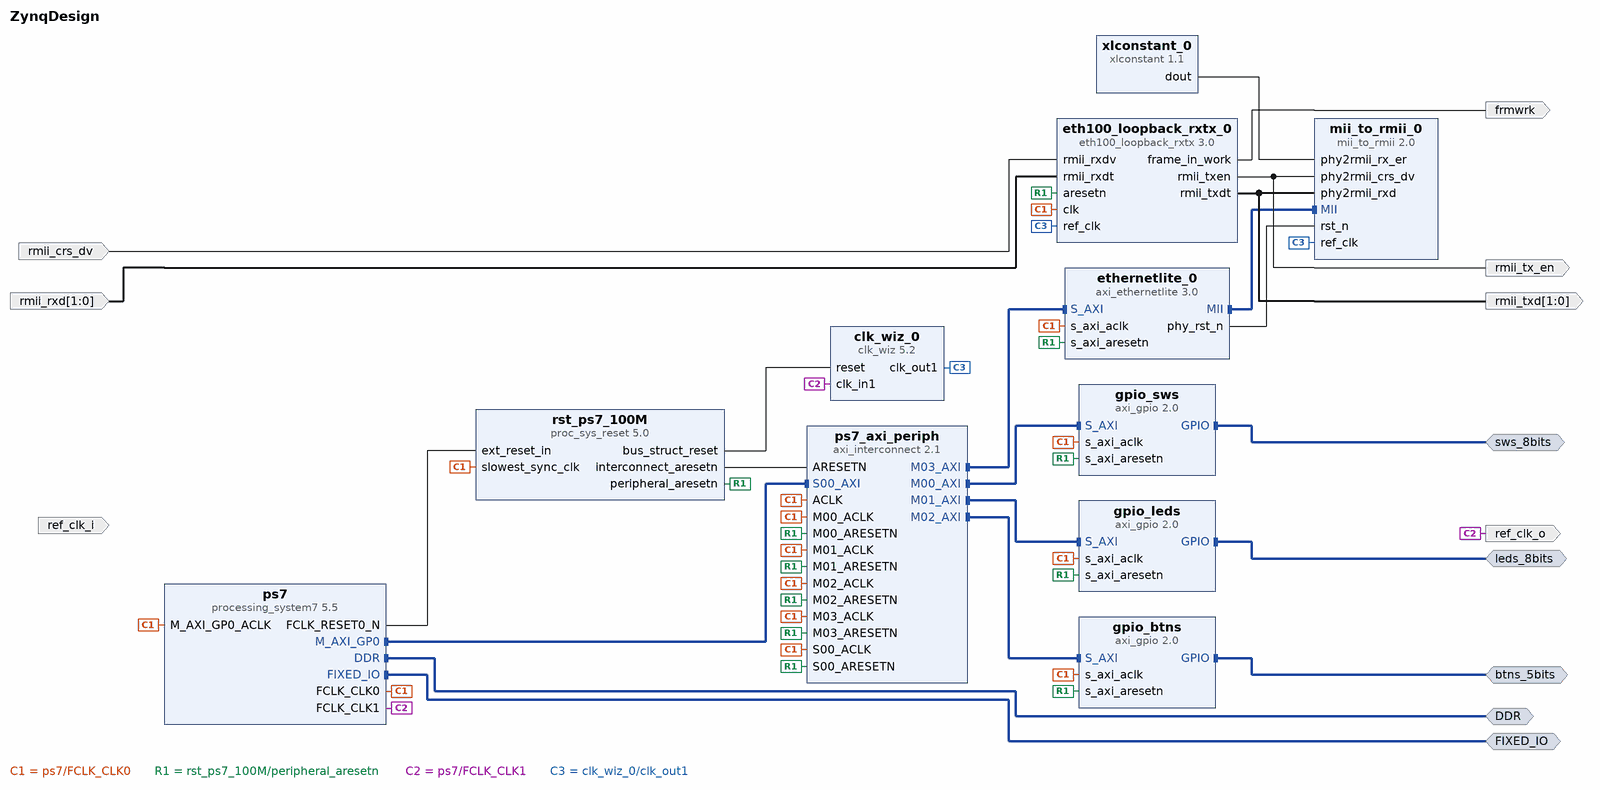
[diagram p0: block diagram of the top level]
# Vivado block design ZynqDesign, Vivado 2015.3
create_bd_design ZynqDesign

create_bd_intf_port -mode Master -vlnv xilinx.com:interface:ddrx_rtl:1.0 DDR
create_bd_intf_port -mode Master -vlnv xilinx.com:display_processing_system7:fixedio_rtl:1.0 FIXED_IO
create_bd_intf_port -mode Master -vlnv xilinx.com:interface:gpio_rtl:1.0 sws_8bits
create_bd_intf_port -mode Master -vlnv xilinx.com:interface:gpio_rtl:1.0 leds_8bits
create_bd_intf_port -mode Master -vlnv xilinx.com:interface:gpio_rtl:1.0 btns_5bits
create_bd_port -dir I -type clk ref_clk_i
set_property -dict {CONFIG.FREQ_HZ 50000000} [get_bd_ports ref_clk_i]
create_bd_port -dir O -type clk ref_clk_o
create_bd_port -dir O rmii_tx_en
create_bd_port -dir O -from 1 -to 0 rmii_txd
create_bd_port -dir I rmii_crs_dv
create_bd_port -dir I -from 1 -to 0 rmii_rxd
create_bd_port -dir O -type data frmwrk

create_bd_cell -type ip -vlnv xilinx.com:ip:processing_system7:5.5 ps7
set_property -dict [list \
  CONFIG.PCW_FPGA1_PERIPHERAL_FREQMHZ 50 \
  CONFIG.PCW_EN_CLK1_PORT 1 \
  CONFIG.PCW_QSPI_GRP_SINGLE_SS_ENABLE 1 \
  CONFIG.preset ZedBoard \
] [get_bd_cells ps7]
# 1 more settings of ps7 are not shown: defaults, MIO pin electricals, DDR timing, and values the tool derives
create_bd_cell -type ip -vlnv xilinx.com:ip:axi_gpio:2.0 gpio_sws
set_property -dict {CONFIG.USE_BOARD_FLOW true CONFIG.GPIO_BOARD_INTERFACE sws_8bits} [get_bd_cells gpio_sws]
create_bd_cell -type ip -vlnv xilinx.com:ip:axi_interconnect:2.1 ps7_axi_periph
set_property -dict {CONFIG.NUM_MI 4} [get_bd_cells ps7_axi_periph]
create_bd_cell -type ip -vlnv xilinx.com:ip:proc_sys_reset:5.0 rst_ps7_100M
create_bd_cell -type ip -vlnv xilinx.com:ip:axi_gpio:2.0 gpio_leds
set_property -dict {CONFIG.USE_BOARD_FLOW true CONFIG.GPIO_BOARD_INTERFACE leds_8bits} [get_bd_cells gpio_leds]
create_bd_cell -type ip -vlnv xilinx.com:ip:axi_gpio:2.0 gpio_btns
set_property -dict {CONFIG.USE_BOARD_FLOW true CONFIG.GPIO_BOARD_INTERFACE btns_5bits} [get_bd_cells gpio_btns]
create_bd_cell -type ip -vlnv xilinx.com:ip:axi_ethernetlite:3.0 ethernetlite_0
set_property -dict {CONFIG.C_INCLUDE_INTERNAL_LOOPBACK 1 CONFIG.C_INCLUDE_MDIO 0} [get_bd_cells ethernetlite_0]
create_bd_cell -type ip -vlnv xilinx.com:ip:mii_to_rmii:2.0 mii_to_rmii_0
create_bd_cell -type ip -vlnv xilinx.com:ip:xlconstant:1.1 xlconstant_0
set_property -dict {CONFIG.CONST_VAL 0} [get_bd_cells xlconstant_0]
create_bd_cell -type ip -vlnv xilinx.com:ip:clk_wiz:5.2 clk_wiz_0
set_property -dict [list \
  CONFIG.CLKOUT1_REQUESTED_OUT_FREQ 50 \
  CONFIG.CLKOUT1_REQUESTED_PHASE 180 \
  CONFIG.MMCM_DIVCLK_DIVIDE 1 \
  CONFIG.MMCM_CLKOUT0_DIVIDE_F 20.000 \
  CONFIG.MMCM_CLKOUT0_PHASE 180.000 \
  CONFIG.CLKOUT1_JITTER 192.113 \
] [get_bd_cells clk_wiz_0]
create_bd_cell -type ip -vlnv jsykora.info:user:eth100_loopback_rxtx:3.0 eth100_loopback_rxtx_0

# ---- connections ----

connect_bd_intf_net -intf_net processing_system7_0_M_AXI_GP0 [get_bd_intf_pins ps7/M_AXI_GP0] [get_bd_intf_pins ps7_axi_periph/S00_AXI]
connect_bd_intf_net [get_bd_intf_pins ps7_axi_periph/M00_AXI] [get_bd_intf_pins gpio_sws/S_AXI]
connect_bd_intf_net [get_bd_intf_pins ps7_axi_periph/M01_AXI] [get_bd_intf_pins gpio_leds/S_AXI]
connect_bd_intf_net [get_bd_intf_pins ps7_axi_periph/M02_AXI] [get_bd_intf_pins gpio_btns/S_AXI]
connect_bd_intf_net [get_bd_intf_pins ps7_axi_periph/M03_AXI] [get_bd_intf_pins ethernetlite_0/S_AXI]
connect_bd_intf_net [get_bd_intf_pins ethernetlite_0/MII] [get_bd_intf_pins mii_to_rmii_0/MII]
connect_bd_intf_net -intf_net processing_system7_0_DDR [get_bd_intf_ports DDR] [get_bd_intf_pins ps7/DDR]
connect_bd_intf_net -intf_net processing_system7_0_FIXED_IO [get_bd_intf_ports FIXED_IO] [get_bd_intf_pins ps7/FIXED_IO]
connect_bd_intf_net -intf_net axi_gpio_0_GPIO [get_bd_intf_ports sws_8bits] [get_bd_intf_pins gpio_sws/GPIO]
connect_bd_intf_net [get_bd_intf_ports leds_8bits] [get_bd_intf_pins gpio_leds/GPIO]
connect_bd_intf_net [get_bd_intf_ports btns_5bits] [get_bd_intf_pins gpio_btns/GPIO]
connect_bd_net -net processing_system7_0_FCLK_RESET0_N [get_bd_pins ps7/FCLK_RESET0_N] [get_bd_pins rst_ps7_100M/ext_reset_in]
connect_bd_net -net rst_processing_system7_0_100M_interconnect_aresetn [get_bd_pins rst_ps7_100M/interconnect_aresetn] \
  [get_bd_pins ps7_axi_periph/ARESETN]
connect_bd_net -net processing_system7_0_FCLK_CLK0 [get_bd_pins ps7/FCLK_CLK0] \
  [get_bd_pins ps7/M_AXI_GP0_ACLK] [get_bd_pins gpio_sws/s_axi_aclk] [get_bd_pins gpio_leds/s_axi_aclk] \
  [get_bd_pins gpio_btns/s_axi_aclk] [get_bd_pins ethernetlite_0/s_axi_aclk] [get_bd_pins rst_ps7_100M/slowest_sync_clk] \
  [get_bd_pins ps7_axi_periph/S00_ACLK] [get_bd_pins ps7_axi_periph/ACLK] [get_bd_pins ps7_axi_periph/M00_ACLK] \
  [get_bd_pins ps7_axi_periph/M01_ACLK] [get_bd_pins ps7_axi_periph/M02_ACLK] [get_bd_pins ps7_axi_periph/M03_ACLK] \
  [get_bd_pins eth100_loopback_rxtx_0/clk]
connect_bd_net -net rst_processing_system7_0_100M_peripheral_aresetn [get_bd_pins rst_ps7_100M/peripheral_aresetn] \
  [get_bd_pins gpio_sws/s_axi_aresetn] [get_bd_pins gpio_leds/s_axi_aresetn] [get_bd_pins gpio_btns/s_axi_aresetn] \
  [get_bd_pins ethernetlite_0/s_axi_aresetn] [get_bd_pins ps7_axi_periph/S00_ARESETN] \
  [get_bd_pins ps7_axi_periph/M00_ARESETN] [get_bd_pins ps7_axi_periph/M01_ARESETN] [get_bd_pins ps7_axi_periph/M02_ARESETN] \
  [get_bd_pins ps7_axi_periph/M03_ARESETN] [get_bd_pins eth100_loopback_rxtx_0/aresetn]
connect_bd_net [get_bd_pins ethernetlite_0/phy_rst_n] [get_bd_pins mii_to_rmii_0/rst_n]
connect_bd_net [get_bd_pins xlconstant_0/dout] [get_bd_pins mii_to_rmii_0/phy2rmii_rx_er]
connect_bd_net [get_bd_pins ps7/FCLK_CLK1] [get_bd_ports ref_clk_o] [get_bd_pins clk_wiz_0/clk_in1]
connect_bd_net [get_bd_pins clk_wiz_0/clk_out1] [get_bd_pins mii_to_rmii_0/ref_clk] [get_bd_pins eth100_loopback_rxtx_0/ref_clk]
connect_bd_net [get_bd_pins rst_ps7_100M/bus_struct_reset] [get_bd_pins clk_wiz_0/reset]
connect_bd_net -net eth100_link_tx_0_rmii_txen [get_bd_pins eth100_loopback_rxtx_0/rmii_txen] \
  [get_bd_ports rmii_tx_en] [get_bd_pins mii_to_rmii_0/phy2rmii_crs_dv]
connect_bd_net -net eth100_link_tx_0_rmii_txdt [get_bd_pins eth100_loopback_rxtx_0/rmii_txdt] \
  [get_bd_ports rmii_txd] [get_bd_pins mii_to_rmii_0/phy2rmii_rxd]
connect_bd_net [get_bd_ports rmii_crs_dv] [get_bd_pins eth100_loopback_rxtx_0/rmii_rxdv]
connect_bd_net [get_bd_ports rmii_rxd] [get_bd_pins eth100_loopback_rxtx_0/rmii_rxdt]
connect_bd_net [get_bd_pins eth100_loopback_rxtx_0/frame_in_work] [get_bd_ports frmwrk]

# ---- address map ----
assign_bd_address -offset 0x40E00000 -range 64K -target_address_space [get_bd_addr_spaces ps7/Data] [get_bd_addr_segs ethernetlite_0/S_AXI/Reg]
assign_bd_address -offset 0x41200000 -range 64K -target_address_space [get_bd_addr_spaces ps7/Data] [get_bd_addr_segs gpio_sws/S_AXI/Reg]
assign_bd_address -offset 0x41210000 -range 64K -target_address_space [get_bd_addr_spaces ps7/Data] [get_bd_addr_segs gpio_leds/S_AXI/Reg]
assign_bd_address -offset 0x41220000 -range 64K -target_address_space [get_bd_addr_spaces ps7/Data] [get_bd_addr_segs gpio_btns/S_AXI/Reg]

validate_bd_design
save_bd_design
